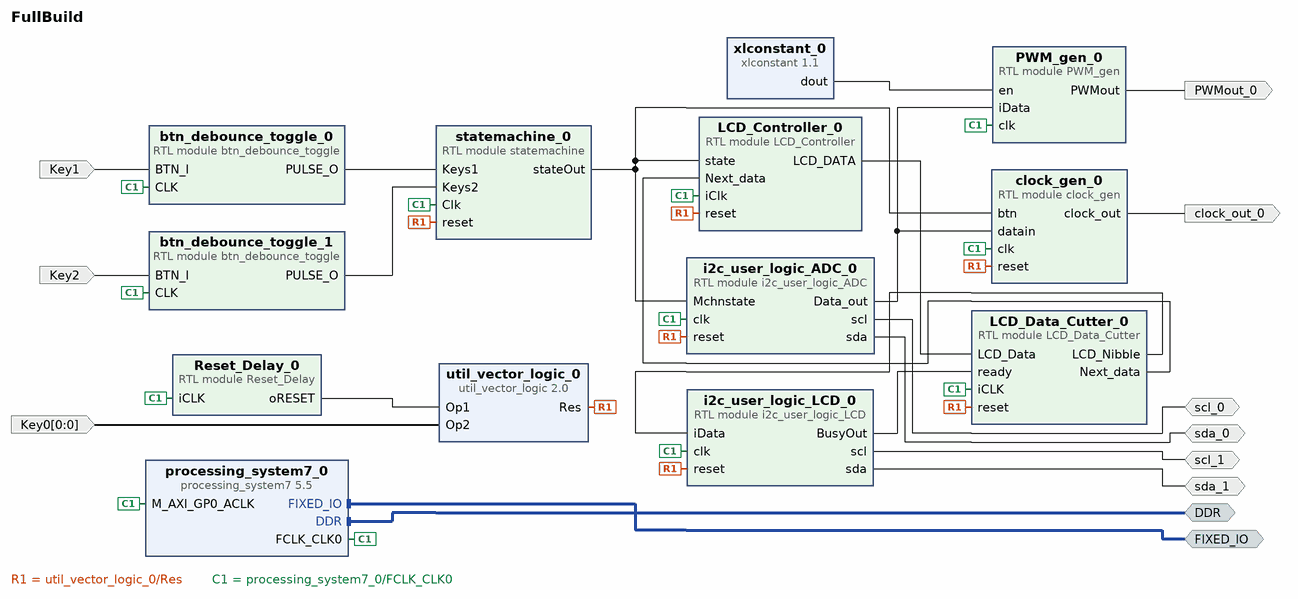
[diagram p0: block diagram of the top level]
# Vivado block design FullBuild, xc7z010clg225-1, Vivado 2019.1
create_bd_design FullBuild

create_bd_intf_port -mode Master -vlnv xilinx.com:interface:ddrx_rtl:1.0 DDR
create_bd_intf_port -mode Master -vlnv xilinx.com:display_processing_system7:fixedio_rtl:1.0 FIXED_IO
create_bd_port -dir I -from 0 -to 0 Key0
create_bd_port -dir I Key1
create_bd_port -dir I Key2
create_bd_port -dir O PWMout_0
create_bd_port -dir IO scl_0
create_bd_port -dir IO sda_0
create_bd_port -dir IO scl_1
create_bd_port -dir IO sda_1
create_bd_port -dir O -type clk clock_out_0

create_bd_cell -type module -reference Reset_Delay Reset_Delay_0
create_bd_cell -type module -reference statemachine statemachine_0
create_bd_cell -type module -reference btn_debounce_toggle btn_debounce_toggle_0
create_bd_cell -type module -reference btn_debounce_toggle btn_debounce_toggle_1
create_bd_cell -type ip -vlnv xilinx.com:ip:util_vector_logic:2.0 util_vector_logic_0
set_property -dict {CONFIG.C_OPERATION or CONFIG.C_SIZE 1} [get_bd_cells util_vector_logic_0]
create_bd_cell -type ip -vlnv xilinx.com:ip:xlconstant:1.1 xlconstant_0
create_bd_cell -type ip -vlnv xilinx.com:ip:processing_system7:5.5 processing_system7_0
set_property -dict [list \
  CONFIG.PCW_CRYSTAL_PERIPHERAL_FREQMHZ 33.33333 \
  CONFIG.PCW_GPIO_MIO_GPIO_ENABLE 1 \
  CONFIG.PCW_GPIO_MIO_GPIO_IO MIO \
  CONFIG.PCW_I2C1_I2C1_IO {MIO 48 .. 49} \
  CONFIG.PCW_I2C1_PERIPHERAL_ENABLE 1 \
  CONFIG.PCW_I2C_PERIPHERAL_FREQMHZ 111.111107 \
  CONFIG.PCW_I2C_RESET_ENABLE 0 \
  CONFIG.PCW_PRESET_BANK1_VOLTAGE {LVCMOS 3.3V} \
  CONFIG.PCW_QSPI_GRP_SINGLE_SS_ENABLE 1 \
  CONFIG.PCW_QSPI_GRP_SINGLE_SS_IO {MIO 1 .. 6} \
  CONFIG.PCW_QSPI_PERIPHERAL_ENABLE 1 \
  CONFIG.PCW_QSPI_QSPI_IO {MIO 1 .. 6} \
  CONFIG.PCW_SD1_GRP_CD_ENABLE 1 \
  CONFIG.PCW_SD1_GRP_CD_IO 0 \
  CONFIG.PCW_SD1_PERIPHERAL_ENABLE 1 \
  CONFIG.PCW_SD1_SD1_IO {MIO 10 .. 15} \
  CONFIG.PCW_SDIO_PERIPHERAL_FREQMHZ 100 \
  CONFIG.PCW_SINGLE_QSPI_DATA_MODE x4 \
  CONFIG.PCW_TTC0_PERIPHERAL_ENABLE 1 \
  CONFIG.PCW_TTC0_TTC0_IO EMIO \
  CONFIG.PCW_TTC1_PERIPHERAL_ENABLE 1 \
  CONFIG.PCW_TTC1_TTC1_IO EMIO \
  CONFIG.PCW_UART1_PERIPHERAL_ENABLE 1 \
  CONFIG.PCW_UART1_UART1_IO {MIO 8 .. 9} \
  CONFIG.PCW_UART_PERIPHERAL_FREQMHZ 100 \
  CONFIG.PCW_UIPARAM_DDR_MEMORY_TYPE {DDR 3 (Low Voltage)} \
  CONFIG.PCW_UIPARAM_DDR_PARTNO {MT41J64M16 JT-125G} \
  CONFIG.PCW_USB0_PERIPHERAL_ENABLE 1 \
  CONFIG.PCW_USB0_RESET_ENABLE 1 \
  CONFIG.PCW_USB0_RESET_IO {MIO 7} \
  CONFIG.PCW_USB0_USB0_IO {MIO 28 .. 39} \
  CONFIG.PCW_USB_RESET_ENABLE 1 \
  CONFIG.PCW_USB_RESET_SELECT {Share reset pin} \
  CONFIG.PCW_WDT_PERIPHERAL_ENABLE 1 \
  CONFIG.PCW_WDT_WDT_IO EMIO \
] [get_bd_cells processing_system7_0]
# 149 more settings of processing_system7_0 are not shown: defaults, MIO pin electricals, DDR timing, and values the tool derives
create_bd_cell -type module -reference PWM_gen PWM_gen_0
create_bd_cell -type module -reference LCD_Controller LCD_Controller_0
create_bd_cell -type module -reference LCD_Data_Cutter LCD_Data_Cutter_0
create_bd_cell -type module -reference i2c_user_logic_LCD i2c_user_logic_LCD_0
create_bd_cell -type module -reference clock_gen clock_gen_0
create_bd_cell -type module -reference i2c_user_logic_ADC i2c_user_logic_ADC_0

# ---- connections ----

connect_bd_intf_net [get_bd_intf_ports FIXED_IO] [get_bd_intf_pins processing_system7_0/FIXED_IO]
connect_bd_intf_net [get_bd_intf_ports DDR] [get_bd_intf_pins processing_system7_0/DDR]
connect_bd_net [get_bd_pins Reset_Delay_0/oRESET] [get_bd_pins util_vector_logic_0/Op1]
connect_bd_net [get_bd_pins util_vector_logic_0/Res] \
  [get_bd_pins statemachine_0/reset] [get_bd_pins LCD_Controller_0/reset] [get_bd_pins LCD_Data_Cutter_0/reset] \
  [get_bd_pins i2c_user_logic_LCD_0/reset] [get_bd_pins clock_gen_0/reset] [get_bd_pins i2c_user_logic_ADC_0/reset]
connect_bd_net [get_bd_pins btn_debounce_toggle_0/PULSE_O] [get_bd_pins statemachine_0/Keys1]
connect_bd_net [get_bd_pins btn_debounce_toggle_1/PULSE_O] [get_bd_pins statemachine_0/Keys2]
connect_bd_net [get_bd_pins xlconstant_0/dout] [get_bd_pins PWM_gen_0/en]
connect_bd_net [get_bd_pins statemachine_0/stateOut] \
  [get_bd_pins LCD_Controller_0/state] [get_bd_pins clock_gen_0/btn] [get_bd_pins i2c_user_logic_ADC_0/Mchnstate]
connect_bd_net [get_bd_pins processing_system7_0/FCLK_CLK0] \
  [get_bd_pins processing_system7_0/M_AXI_GP0_ACLK] [get_bd_pins statemachine_0/Clk] [get_bd_pins btn_debounce_toggle_0/CLK] \
  [get_bd_pins btn_debounce_toggle_1/CLK] [get_bd_pins Reset_Delay_0/iCLK] [get_bd_pins PWM_gen_0/clk] \
  [get_bd_pins LCD_Controller_0/iClk] [get_bd_pins LCD_Data_Cutter_0/iCLK] [get_bd_pins i2c_user_logic_LCD_0/clk] \
  [get_bd_pins clock_gen_0/clk] [get_bd_pins i2c_user_logic_ADC_0/clk]
connect_bd_net -net Op2_0_1 [get_bd_ports Key0] [get_bd_pins util_vector_logic_0/Op2]
connect_bd_net -net BTN_I_0_1 [get_bd_ports Key1] [get_bd_pins btn_debounce_toggle_0/BTN_I]
connect_bd_net -net BTN_I_0_2 [get_bd_ports Key2] [get_bd_pins btn_debounce_toggle_1/BTN_I]
connect_bd_net [get_bd_pins LCD_Controller_0/LCD_DATA] [get_bd_pins LCD_Data_Cutter_0/LCD_Data]
connect_bd_net [get_bd_pins i2c_user_logic_LCD_0/BusyOut] [get_bd_pins LCD_Data_Cutter_0/ready]
connect_bd_net [get_bd_pins LCD_Data_Cutter_0/LCD_Nibble] [get_bd_pins i2c_user_logic_LCD_0/iData]
connect_bd_net [get_bd_pins LCD_Data_Cutter_0/Next_data] [get_bd_pins LCD_Controller_0/Next_data]
connect_bd_net [get_bd_pins PWM_gen_0/PWMout] [get_bd_ports PWMout_0]
connect_bd_net [get_bd_ports scl_0] [get_bd_pins i2c_user_logic_ADC_0/scl]
connect_bd_net [get_bd_ports sda_0] [get_bd_pins i2c_user_logic_ADC_0/sda]
connect_bd_net [get_bd_ports scl_1] [get_bd_pins i2c_user_logic_LCD_0/scl]
connect_bd_net [get_bd_ports sda_1] [get_bd_pins i2c_user_logic_LCD_0/sda]
connect_bd_net [get_bd_pins i2c_user_logic_ADC_0/Data_out] [get_bd_pins PWM_gen_0/iData] [get_bd_pins clock_gen_0/datain]
connect_bd_net [get_bd_pins clock_gen_0/clock_out] [get_bd_ports clock_out_0]

validate_bd_design
save_bd_design
